# Altium schematic sheet LCD TFT 50 Pin.SchDoc
size A; SheetNumber: 6; SheetTotal: 13
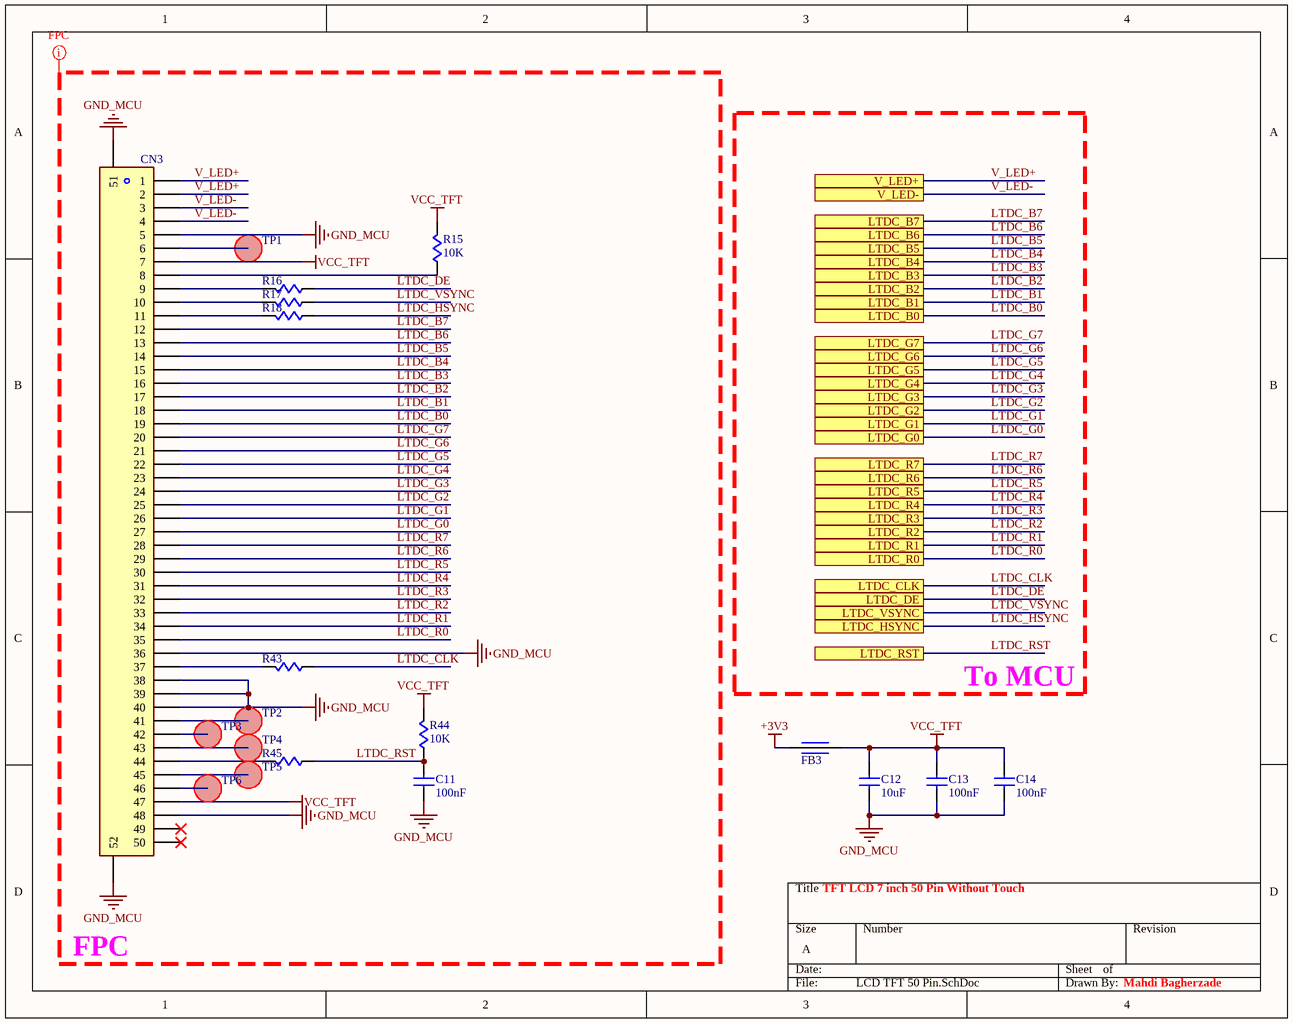
[diagram p0: LCD TFT 50 Pin.SchDoc]

## Parts
C11  value 100nF  [C-0805]  (hidden comment: CAP Cer 100nF-50V-X7R-SMD)
C12  value 10uF  [C-0805]  (hidden comment: CAP Cer 10uF-50V-X7R-SMD)
C13  value 100nF  [C-0805]  (hidden comment: CAP Cer 100nF-50V-X7R-SMD)
C14  value 100nF  [C-0805]  (hidden comment: CAP Cer 100nF-50V-X7R-SMD)
CN3  Connector FPC Right-0.5mm-50 Pin  [CN-FPC-50-0.5mm-hor]  (value not drawn)
FB3  Ferrite Bead SMD  [FB-0805]  (value not drawn)
R15  value 10K  [R-0805]  (hidden comment: RES 10K-5%-1/8W-SMD)
R16  RES 10R-5%-1/8W-SMD  [R-0805]  (value not drawn)
R17  RES 10R-5%-1/8W-SMD  [R-0805]  (value not drawn)
R18  RES 10R-5%-1/8W-SMD  [R-0805]  (value not drawn)
R43  RES 10R-5%-1/8W-SMD  [R-0805]  (value not drawn)
R44  value 10K  [R-0805]  (hidden comment: RES 10K-5%-1/8W-SMD)
R45  RES 10R-5%-1/8W-SMD  [R-0805]  (value not drawn)
TP1  (no value)  [TEST POINT-SMD]  (net tie, no BOM)
TP2  (no value)  [TEST POINT-SMD]  (net tie, no BOM)
TP3  (no value)  [TEST POINT-SMD]  (net tie, no BOM)
TP4  (no value)  [TEST POINT-SMD]  (net tie, no BOM)
TP5  (no value)  [TEST POINT-SMD]  (net tie, no BOM)
TP6  (no value)  [TEST POINT-SMD]  (net tie, no BOM)

## Ports
LTDC_B0 (see Interface[6C]), LTDC_B1 (see Interface[6C]), LTDC_B2 (see Interface[6C], MCU[5B]), LTDC_B3 (see Interface[6C], MCU[3C]), LTDC_B4 (see Interface[6C], MCU[3C]), LTDC_B5 (see Interface[6C], MCU[3A]), LTDC_B6 (see Interface[6B], MCU[5A]), LTDC_B7 (see Interface[6B], MCU[5A]), LTDC_CLK (see Interface[6C], MCU[3C]), LTDC_DE (see Interface[6C], MCU[5C]), LTDC_G0 (see Interface[6C]), LTDC_G1 (see Interface[6C]), LTDC_G2 (see Interface[6C], MCU[3A]), LTDC_G3 (see Interface[6C], MCU[3C]), LTDC_G4 (see Interface[6C], MCU[5A]), LTDC_G5 (see Interface[6C], MCU[5A]), LTDC_G6 (see Interface[6C], MCU[3B]), LTDC_G7 (see Interface[6C], MCU[5B]), LTDC_HSYNC (see Interface[6D], MCU[3B]), LTDC_R0 (see Interface[6C]), LTDC_R1 (see Interface[6C]), LTDC_R2 (see Interface[6C], MCU[3B]), LTDC_R3 (see Interface[6C], MCU[5A]), LTDC_R4 (see Interface[6C], MCU[3A]), LTDC_R5 (see Interface[6C], MCU[3A]), LTDC_R6 (see Interface[6C], MCU[5A]), LTDC_R7 (see Interface[6C], MCU[3C]), LTDC_RST (see Interface[6D], MCU[3B]), LTDC_VSYNC (see Interface[6C], MCU[3A]), V_LED+ (see Interface[6D], MC3202[4B]), V_LED- (see Interface[6D], MC3202[3B])

## Nets
+3V3: FB3.1
GND_MCU: C11.1 C12.2 C13.2 C14.2 CN3.5 CN3.36 CN3.38 CN3.39 CN3.40 CN3.48 CN3.51 CN3.52
VCC_TFT: C12.1 C13.1 C14.1 CN3.7 CN3.47 FB3.2 R15.2 R44.2
LTDC_B0: CN3.19 ; port LTDC_B0
LTDC_B1: CN3.18 ; port LTDC_B1
LTDC_B2: CN3.17 ; port LTDC_B2
LTDC_B3: CN3.16 ; port LTDC_B3
LTDC_B4: CN3.15 ; port LTDC_B4
LTDC_B5: CN3.14 ; port LTDC_B5
LTDC_B6: CN3.13 ; port LTDC_B6
LTDC_B7: CN3.12 ; port LTDC_B7
LTDC_CLK: R43.1 ; port LTDC_CLK
LTDC_DE: R16.1 ; port LTDC_DE
LTDC_G0: CN3.27 ; port LTDC_G0
LTDC_G1: CN3.26 ; port LTDC_G1
LTDC_G2: CN3.25 ; port LTDC_G2
LTDC_G3: CN3.24 ; port LTDC_G3
LTDC_G4: CN3.23 ; port LTDC_G4
LTDC_G5: CN3.22 ; port LTDC_G5
LTDC_G6: CN3.21 ; port LTDC_G6
LTDC_G7: CN3.20 ; port LTDC_G7
LTDC_HSYNC: R18.1 ; port LTDC_HSYNC
LTDC_R0: CN3.35 ; port LTDC_R0
LTDC_R1: CN3.34 ; port LTDC_R1
LTDC_R2: CN3.33 ; port LTDC_R2
LTDC_R3: CN3.32 ; port LTDC_R3
LTDC_R4: CN3.31 ; port LTDC_R4
LTDC_R5: CN3.30 ; port LTDC_R5
LTDC_R6: CN3.29 ; port LTDC_R6
LTDC_R7: CN3.28 ; port LTDC_R7
LTDC_RST: C11.2 R44.1 R45.1 ; port LTDC_RST
LTDC_VSYNC: R17.1 ; port LTDC_VSYNC
V_LED+: CN3.1 CN3.2 ; port V_LED+
V_LED-: CN3.3 CN3.4 ; port V_LED-
NetCN3_6: CN3.6 TP1.1(TP)
NetCN3_8: CN3.8 R15.1
NetCN3_9: CN3.9 R16.2
NetCN3_10: CN3.10 R17.2
NetCN3_11: CN3.11 R18.2
NetCN3_37: CN3.37 R43.2
NetCN3_41: CN3.41 TP2.1(TP)
NetCN3_42: CN3.42 TP3.1(TP)
NetCN3_43: CN3.43 TP4.1(TP)
NetCN3_44: CN3.44 R45.2
NetCN3_45: CN3.45 TP5.1(TP)
NetCN3_46: CN3.46 TP6.1(TP)

Not connected (* = marked no-connect by the designer): CN3 49* 50*

## Layout directives
net class FPC: GND_MCU, LTDC_B0, LTDC_B1, LTDC_B2, LTDC_B3, LTDC_B4, LTDC_B5, LTDC_B6, LTDC_B7, LTDC_CLK, LTDC_DE, LTDC_G0, LTDC_G1, LTDC_G2, LTDC_G3, LTDC_G4, LTDC_G5, LTDC_G6, LTDC_G7, LTDC_HSYNC, LTDC_R0, LTDC_R1, LTDC_R2, LTDC_R3, LTDC_R4, LTDC_R5, LTDC_R6, LTDC_R7, LTDC_RST, LTDC_VSYNC, V_LED+, V_LED-, VCC_TFT

## Notes on the sheet
- To MCU
- TFT LCD 7 inch 50 Pin Without Touch
- FPC
- Mahdi Bagherzade

## Library data of the parts
C11-C14 = CAP-CER: CAPACITOR; Phone Number: 0915 8700 314; Voltage: 50V; Tolerance: X7R; Type: SMD; Publisher: Mahdi Bagherzadeh; ComponentLink1Description: Linkedin; ComponentLink1URL: https://ir.linkedin.com/in/mahdi-bagherzade; Published Date: 9-15-2024
CN3 = CN-FPC-50pin: CONNECTOR; Phone Number: 0915 8700 314; Publisher: Mahdi Bagherzadeh; ComponentLink1Description: Linkedin; ComponentLink1URL: https://ir.linkedin.com/in/mahdi-bagherzade; Published Date: 9-15-2024; Size: 0.5mm-50 Pin; Type: Right
FB3 = FERRITE BEAD: INDUCATOR; Phone Number: 0915 8700 314; Publisher: Mahdi Bagherzadeh; ComponentLink1Description: Linkedin; ComponentLink1URL: https://ir.linkedin.com/in/mahdi-bagherzade; Published Date: 9-15-2024; Type: SMD
R15 R44 = RES: RESISTOR; Phone Number: 0915 8700 314; Power: 1/8W; Tolerance: 5%; Publisher: Mahdi Bagherzadeh; ComponentLink1Description: Linkedin; ComponentLink1URL: https://ir.linkedin.com/in/mahdi-bagherzade; Published Date: 9-15-2024; Type: SMD
R16-R18 R43 R45 = RES: RESISTOR; Phone Number: 0915 8700 314; VALUE: 10R; Power: 1/8W; Tolerance: 5%; Publisher: Mahdi Bagherzadeh; ComponentLink1Description: Linkedin; ComponentLink1URL: https://ir.linkedin.com/in/mahdi-bagherzade; Published Date: 9-15-2024; Type: SMD
TP1-TP6 = TEST PIONT: Phone Number: 0915 8700 314; Publisher: Mahdi Bagherzadeh; ComponentLink1Description: Linkedin; ComponentLink1URL: https://ir.linkedin.com/in/mahdi-bagherzade; Published Date: 9-15-2024